# Altium schematic sheet I2C.SchDoc
size A4; SheetNumber: 5; SheetTotal: 5
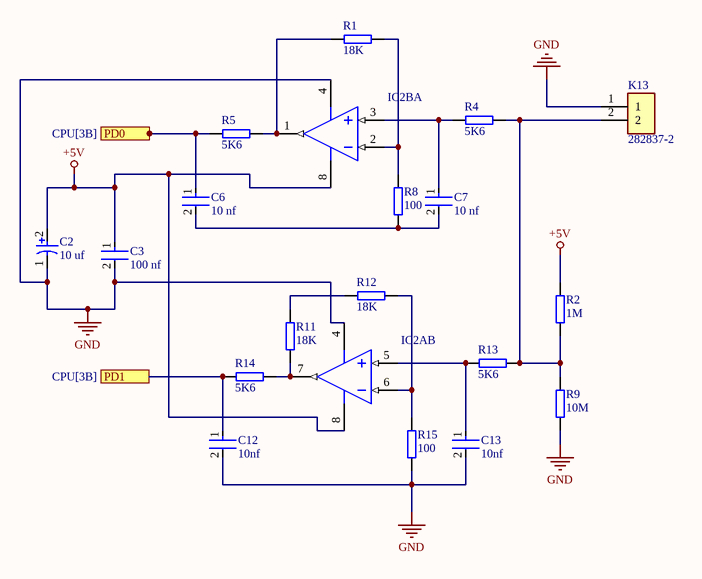
[diagram p0: I2C.SchDoc]

## Parts
C2  10 uf  [CE_D8_L10]
C3  100 nf  [CC_0805_L]
C6  10 nf  [CC_0805_L]
C7  10 nf  [CC_0805_L]
C12  10nf  [CC_0805_L]
C13  10nf  [CC_0805_L]
IC2A  (no value)  [MSOP_8_M]  (part B of 2)
IC2B  (no value)  [MSOP_8_M]  (part A of 2)
K13  282837-2  [TE_282837-2]
R1  18K  [CC_0805_m]
R2  1M  [CC_0805_m]
R4  5K6  [CC_0805_m]
R5  5K6  [CC_0805_m]
R8  100  [CC_0805_m]
R9  10M  [CC_0805_m]
R11  18K  [CC_0805_m]
R12  18K  [CC_0805_m]
R13  5K6  [CC_0805_m]
R14  5K6  [CC_0805_m]
R15  100  [CC_0805_m]

## Ports
PD0 (see CPU[3B]), PD1 (see CPU[3B])

## Nets
+5V: C2.2 C3.1 IC2A.8(VDD) IC2B.8(VDD) R2.2
GND: C2.1 C3.2 C12.2 C13.2 IC2A.4(VSS) IC2B.4(VSS) K13.1 R9.1 R15.1
PD0: C6.1 R5.1 ; port PD0
PD1: C12.1 R14.1 ; port PD1
NetC6_2: C6.2 C7.2 R8.1
NetC7_1: C7.1 IC2B.3(VINA+) R4.1
NetC13_1: C13.1 IC2A.5(VINB+) R13.1
NetIC2A_6: IC2A.6(VINB-) R12.2 R15.2
NetIC2A_7: IC2A.7(VOUTB) R11.1 R14.2
NetIC2B_1: IC2B.1(VOUTA) R1.1 R5.2
NetIC2B_2: IC2B.2(VINA-) R1.2 R8.2
NetK13_2: K13.2 R2.1 R4.2 R9.2 R13.2
NetR11_2: R11.2 R12.1

## Library data of the parts
C2 = Capacitor_Electrolytic: Manufacturer: Panasonic; Voltage Rating: 25 V; ComponentLink2URL: http://industrial.panasonic.com/cdbs/www-data/pdf/RDE0000/ABA0000C1181.pdf; Height: 10.2 mm; Max Operating Temperature: 105 degC; PackageReference: EEE-FK1E221P; ComponentLink1Description: Manufacturer URL; ComponentLink1URL: http://www.panasonic.com/; Mount: Surface Mount; REACH SVHC: No SVHC; Min Operating Temperature: -55 degC; ComponentLink2Description: Datasheet; DatasheetVersion: 03/2016; Length: 10.2 mm; RoHSCompliant: true; Packaging: Tape and Reel; Package Quantity: 500; Lead Pitch: 3.1 mm; Pins: 2; PackageDescription: 2-Pin Electrolytic Aluminum Capacitor, Body 8.3 x 8.3 mm; Mounting Technology: Surface Mount
C3 C6 C7 C12 C13 = Capacitor_Ceramic: Manufacturer: KEMET; Manufacturer Part Number: C0805C224K5RACTU; Value: 0.22 μF; Temperature Characteristic: X7R; Temperature Coefficient: 30ppm/°C; Tolerance: 0.1; Voltage Rating: 50 V; ComponentLink2URL: https://content.kemet.com/datasheets/KEM_C1003_C0G_SMD.pdf; Device Class L3: Ceramic Capacitors; Lead Free: Yes; Temperature: -55°C to +125°C; RoHS: TRUE; Capacitance: 0.22 μF; Automotive: No; Material: Ceramic; Octopart: https://octopart.com/c0805c224k5ractu-kemet-144670; Temperature Range Low: -55°C; Height: 0.88mm; Device Class L1: Passive Components; Digikey Description: CAP CER 0.22UF 50V X7R 0805; ComponentLink2Description: Datasheet; Mouser Description: CAP CER 0.22UF 50V X7R 0805; Category: Cap; Ipc Land Pattern Name: CAPC200125X78; Temperature Range High: +125°C; Package: C0805C-DN; Device Class L2: Capacitors
IC2A IC2B = Dual_Opamp: Slew Rate: 0.6V/µs; Supply Current: 100uA; Power Supply Rejection Ratio (PSRR): 86dB; Input Offset Voltage (Vos): 4.5mV; Input Bias Current: 1pA; Amplifier Type: GENERAL PURPOSE; Unity Gain Bandwidth Product: 1MHz; Number of Circuits: 2; Output Current: 23mA; Operating Supply Voltage: 5.5V; Min Supply Voltage: 1.8V; Common Mode Rejection Ratio: 60dB; Voltage Gain: 112dB; Max Supply Voltage: 6V; Package Quantity: 60; REACH SVHC: No SVHC; Min Operating Temperature: -40°C; Max Operating Temperature: 125°C; Mount: Through Hole; Nominal Supply Current: 100uA; Height: 3.3mm; Length: 9.27mm; Slew Rate-Nom: 0.6V/µs; Packaging: Rail/Tube; Output Current per Channel: 23mA; Number of Amplifiers: 2; RoHS Compliant: Yes; Radiation Hardening: No; Bandwidth: 1MHz; Lead Free: Lead Free; Width: 6.35mm; Number of Channels: 2; Gain Bandwidth Product: 1MHz; Technology: CMOS; Operating Supply Current: 100uA; Number of Elements: 2; Number of Pins: 8; Input Offset Voltage-Max: 4.5mV; Case/Package: PDIP
K13 = 282837-2: Ð Ð°Ð·ÑŠÐµÐ¼Ð½Ñ‹Ðµ ÐºÐ»ÐµÐ¼Ð¼Ð½Ñ‹Ðµ ÐºÐ¾Ð»Ð¾Ð´ÐºÐ¸ Ð Ð¾Ð·ÐµÑ‚ÐºÐ° 2 Ð¿Ð¾Ð»Ð¾Ð¶ÐµÐ½Ð¸Ñ 5,08 Ð¼Ð¼ ÐŸÑ€Ð¸Ð¿Ð¾Ð¹ Ð¿Ñ€ÑÐ¼Ð¾Ð¹ Ñ‡ÐµÑ€ÐµÐ· Ð¾Ñ‚Ð²ÐµÑ€ÑÑ‚Ð¸Ðµ 13,5 Ð / ÐºÐ¾Ð½Ñ‚Ð°ÐºÑ‚; MF: TE Connectivity; SnapEDA_Link: https://www.snapeda.com/parts/282837-2/TE+Connectivity+AMP+Connectors/view-part/?ref=snap; Price: None; Check_prices: https://www.snapeda.com/parts/282837-2/TE+Connectivity+AMP+Connectors/view-part/?ref=eda; Purchase-URL: https://pricing.snapeda.com/search/part/282837-2/?ref=eda; MP: 282837-2; Value: *; Availability: In Stock; Package: None
R1 R2 R4 R5 R8 R9 R11-R15 = Resistor: Manufacturer: Vishay Dale; Part Number: CRCW08050000Z0EA